# Altium schematic sheet Clock_Divider.SchDoc
size A4
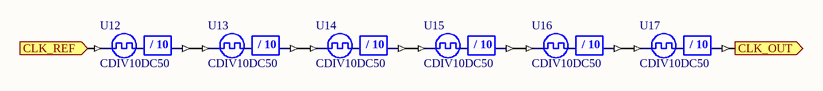
[diagram p0: Clock_Divider.SchDoc]

## Parts
U12  CDIV10DC50
U13  CDIV10DC50
U14  CDIV10DC50
U15  CDIV10DC50
U16  CDIV10DC50
U17  CDIV10DC50

## Ports
CLK_OUT (out), CLK_REF (in)

## Nets
CLK_OUT: U17.CLKDV ; port CLK_OUT
CLK_REF: U12.CLKIN ; port CLK_REF
NetU12_CLKDV: U12.CLKDV U13.CLKIN
NetU13_CLKDV: U13.CLKDV U14.CLKIN
NetU14_CLKDV: U14.CLKDV U15.CLKIN
NetU15_CLKDV: U15.CLKDV U16.CLKIN
NetU16_CLKDV: U16.CLKDV U17.CLKIN

## Notes on the sheet
- (in symbol CDIV10DC50) / 10

## Library data of the parts
U12-U17 = CDIV10DC50: Clock Divider by 10 with 50% Duty Cycle Output; XilinxEquivalent: CLK_DIV10; DivisorRate: 10; DutyCycle: 50; ArchiveName: GENERIC; VHDLIB_SIM: GENERIC_LIB; Published: 29-Jan-2004; Publisher: Altium Limited; LastRevisionNo: 1.00.00; HelpURL: CR0118 FPGA Generic Library Guide.pdf#page=143; ComponentLink1URL: CR0127 FPGA Clock Divider Resource Usage.pdf#page=15; ComponentLink1Description: Core &Resource Usage; FunctionalClass: Clock Divider